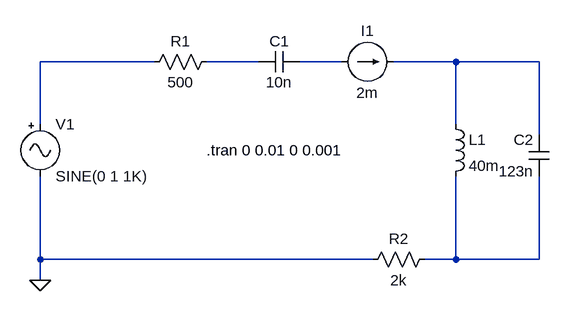
[diagram p0: schematic R__C__I__L_C__R.asc]
R__C__I__L_C__R.asc, the LTspice schematic file:
Version 4
SHEET 1 880 680
WIRE 192 176 16 176
WIRE 352 176 272 176
WIRE 480 176 416 176
WIRE 656 176 560 176
WIRE 784 176 656 176
WIRE 16 272 16 176
WIRE 656 272 656 176
WIRE 784 288 784 176
WIRE 16 480 16 352
WIRE 528 480 16 480
WIRE 656 480 656 352
WIRE 656 480 608 480
WIRE 784 480 784 352
WIRE 784 480 656 480
WIRE 16 512 16 480
FLAG 16 512 0
SYMBOL Misc/signal 16 256 R0
SYMATTR InstName V1
SYMBOL res 288 160 R90
WINDOW 0 0 56 VBottom 2
WINDOW 3 32 56 VTop 2
SYMATTR InstName R1
SYMATTR Value 500
SYMBOL cap 416 160 R90
WINDOW 0 0 32 VBottom 2
WINDOW 3 32 32 VTop 2
SYMATTR InstName C1
SYMATTR Value 10n
SYMBOL cap 800 352 R180
WINDOW 0 24 56 Left 2
WINDOW 3 24 8 Left 2
SYMATTR InstName C2
SYMATTR Value 123n
SYMBOL current 480 176 R270
WINDOW 0 32 40 VTop 2
WINDOW 3 -32 40 VBottom 2
SYMATTR InstName I1
SYMATTR Value 2m
SYMBOL ind 640 256 R0
SYMATTR InstName L1
SYMATTR Value 40m
SYMBOL res 624 464 R90
WINDOW 0 0 56 VBottom 2
WINDOW 3 32 56 VTop 2
SYMATTR InstName R2
SYMATTR Value 2k
TEXT 272 312 Left 2 !.tran 0 0.01 0 0.001

The netlist it stands for:
* R__C__I__L_C__R.asc
V1 N001 0 SINE(0 1 1K)
R1 N002 N001 500
C1 N003 N002 10n
C2 N005 N004 123n
I1 N003 N004 2m
L1 N004 N005 40m
R2 N005 0 2k
.tran 0 0.01 0 0.001
.backanno
.end